# Altium schematic sheet Ind_current_sensor.SchDoc
size 508 x 508 mm
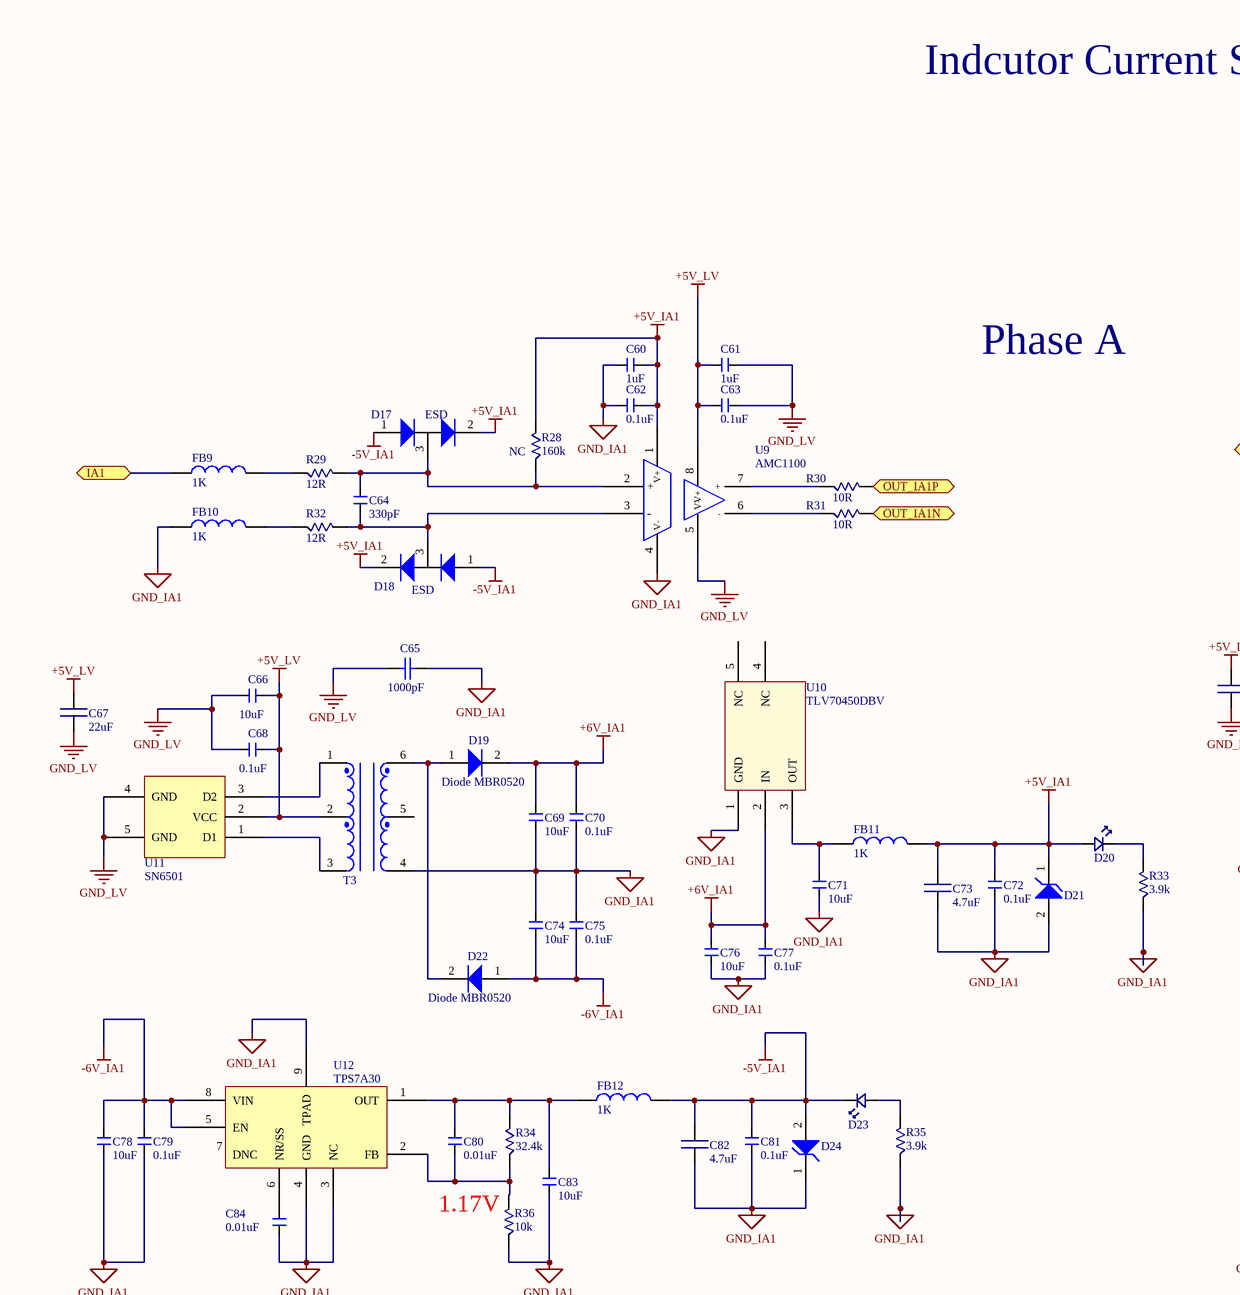
[diagram p0: Ind_current_sensor.SchDoc, top left]
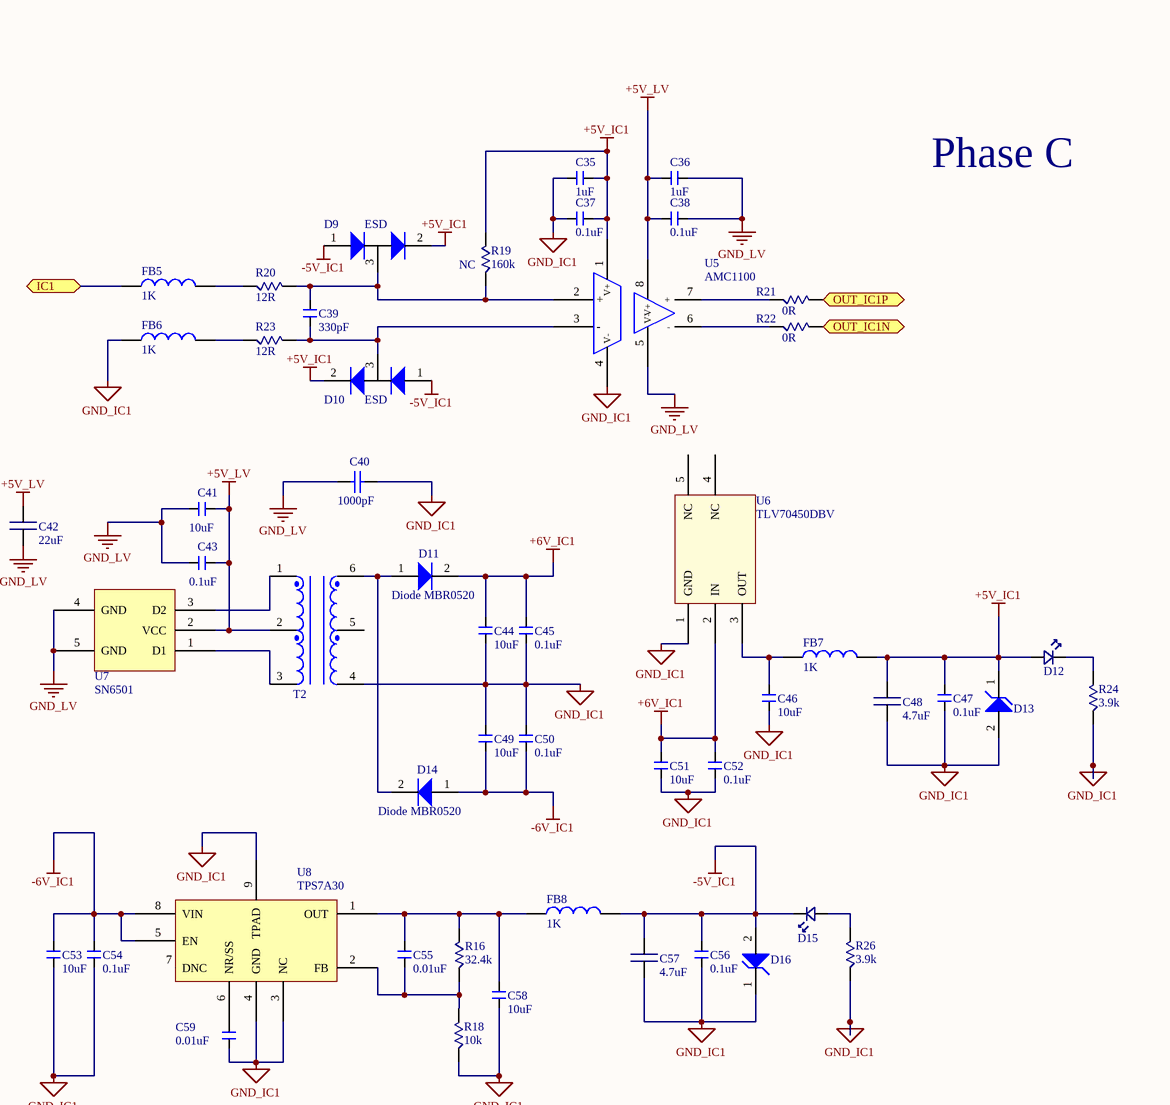
[diagram p1: Ind_current_sensor.SchDoc, top right]
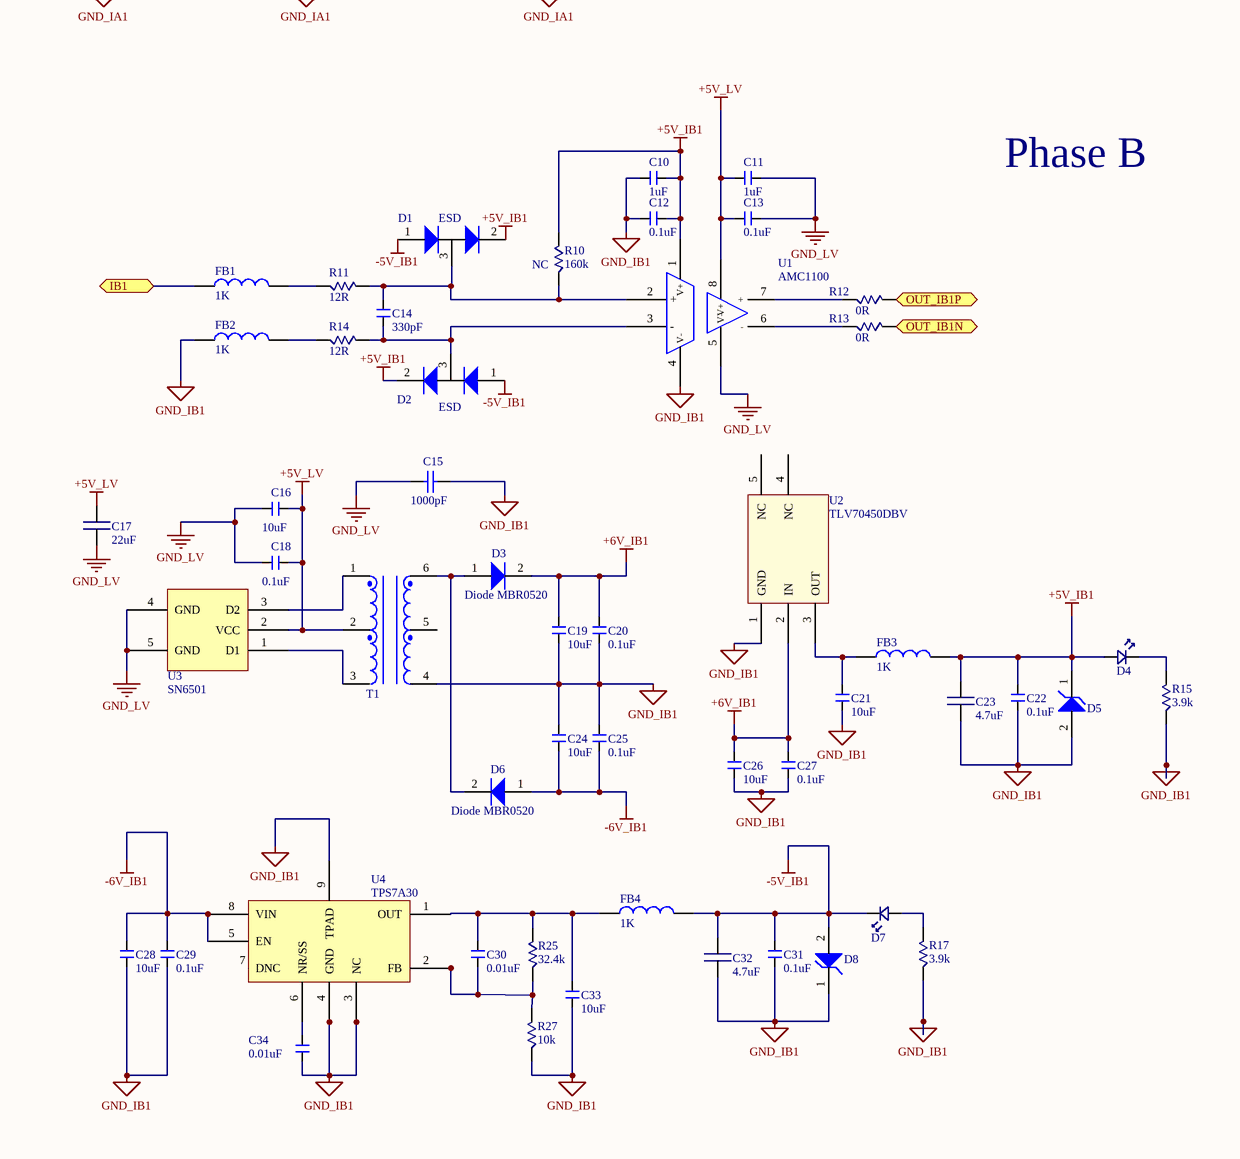
[diagram p2: Ind_current_sensor.SchDoc, bottom left]
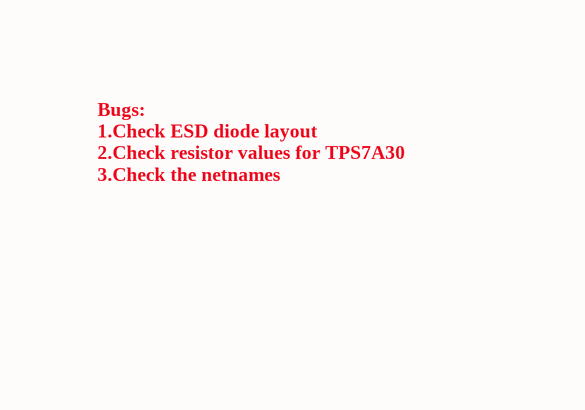
[diagram p3: Ind_current_sensor.SchDoc, bottom right]

## Parts
C10  value 1uF  [0603 (1608 Metric)]  (hidden comment: Cap 0603_new)
C11  value 1uF  [0603 (1608 Metric)]  (hidden comment: Cap 0603_new)
C12  value 0.1uF  [0603 (1608 Metric)]  (hidden comment: Cap 0603_new)
C13  value 0.1uF  [0603 (1608 Metric)]  (hidden comment: Cap 0603_new)
C14  value 330pF  [0603 (1608 Metric)]  (hidden comment: Cap 0603_new)
C15  value 1000pF  [RAD-0.3]  (hidden comment: Cap TH)
C16  value 10uF  [0603 (1608 Metric)]  (hidden comment: Cap 0603_new)
C17  value 22uF  [0805 (2012 metric)]  (hidden comment: Cap 0805)
C18  value 0.1uF  [0603 (1608 Metric)]  (hidden comment: Cap 0603_new)
C19  value 10uF  [0603 (1608 Metric)]  (hidden comment: Cap 0603_new)
C20  value 0.1uF  [0603 (1608 Metric)]  (hidden comment: Cap 0603_new)
C21  value 10uF  [0603 (1608 Metric)]  (hidden comment: Cap 0603_new)
C22  value 0.1uF  [0603 (1608 Metric)]  (hidden comment: Cap 0603_new)
C23  value 4.7uF  [0805 (2012 metric)]  (hidden comment: Cap 0805)
C24  value 10uF  [0603 (1608 Metric)]  (hidden comment: Cap 0603_new)
C25  value 0.1uF  [0603 (1608 Metric)]  (hidden comment: Cap 0603_new)
C26  value 10uF  [0603 (1608 Metric)]  (hidden comment: Cap 0603_new)
C27  value 0.1uF  [0603 (1608 Metric)]  (hidden comment: Cap 0603_new)
C28  value 10uF  [0603 (1608 Metric)]  (hidden comment: Cap 0603_new)
C29  value 0.1uF  [0603 (1608 Metric)]  (hidden comment: Cap 0603_new)
C30  value 0.01uF  [0603 (1608 Metric)]  (hidden comment: Cap 0603_new)
C31  value 0.1uF  [0603 (1608 Metric)]  (hidden comment: Cap 0603_new)
C32  value 4.7uF  [0805 (2012 metric)]  (hidden comment: Cap 0805)
C33  value 10uF  [0603 (1608 Metric)]  (hidden comment: Cap 0603_new)
C34  value 0.01uF  [0603 (1608 Metric)]  (hidden comment: Cap 0603_new)
C35  value 1uF  [0603 (1608 Metric)]  (hidden comment: Cap 0603_new)
C36  value 1uF  [0603 (1608 Metric)]  (hidden comment: Cap 0603_new)
C37  value 0.1uF  [0603 (1608 Metric)]  (hidden comment: Cap 0603_new)
C38  value 0.1uF  [0603 (1608 Metric)]  (hidden comment: Cap 0603_new)
C39  value 330pF  [0603 (1608 Metric)]  (hidden comment: Cap 0603_new)
C40  value 1000pF  [RAD-0.3]  (hidden comment: Cap TH)
C41  value 10uF  [0603 (1608 Metric)]  (hidden comment: Cap 0603_new)
C42  value 22uF  [0805 (2012 metric)]  (hidden comment: Cap 0805)
C43  value 0.1uF  [0603 (1608 Metric)]  (hidden comment: Cap 0603_new)
C44  value 10uF  [0603 (1608 Metric)]  (hidden comment: Cap 0603_new)
C45  value 0.1uF  [0603 (1608 Metric)]  (hidden comment: Cap 0603_new)
C46  value 10uF  [0603 (1608 Metric)]  (hidden comment: Cap 0603_new)
C47  value 0.1uF  [0603 (1608 Metric)]  (hidden comment: Cap 0603_new)
C48  value 4.7uF  [0805 (2012 metric)]  (hidden comment: Cap 0805)
C49  value 10uF  [0603 (1608 Metric)]  (hidden comment: Cap 0603_new)
C50  value 0.1uF  [0603 (1608 Metric)]  (hidden comment: Cap 0603_new)
C51  value 10uF  [0603 (1608 Metric)]  (hidden comment: Cap 0603_new)
C52  value 0.1uF  [0603 (1608 Metric)]  (hidden comment: Cap 0603_new)
C53  value 10uF  [0603 (1608 Metric)]  (hidden comment: Cap 0603_new)
C54  value 0.1uF  [0603 (1608 Metric)]  (hidden comment: Cap 0603_new)
C55  value 0.01uF  [0603 (1608 Metric)]  (hidden comment: Cap 0603_new)
C56  value 0.1uF  [0603 (1608 Metric)]  (hidden comment: Cap 0603_new)
C57  value 4.7uF  [0805 (2012 metric)]  (hidden comment: Cap 0805)
C58  value 10uF  [0603 (1608 Metric)]  (hidden comment: Cap 0603_new)
C59  value 0.01uF  [0603 (1608 Metric)]  (hidden comment: Cap 0603_new)
C60  value 1uF  [0603 (1608 Metric)]  (hidden comment: Cap 0603_new)
C61  value 1uF  [0603 (1608 Metric)]  (hidden comment: Cap 0603_new)
C62  value 0.1uF  [0603 (1608 Metric)]  (hidden comment: Cap 0603_new)
C63  value 0.1uF  [0603 (1608 Metric)]  (hidden comment: Cap 0603_new)
C64  value 330pF  [0603 (1608 Metric)]  (hidden comment: Cap 0603_new)
C65  value 1000pF  [RAD-0.3]  (hidden comment: Cap TH)
C66  value 10uF  [0603 (1608 Metric)]  (hidden comment: Cap 0603_new)
C67  value 22uF  [0805 (2012 metric)]  (hidden comment: Cap 0805)
C68  value 0.1uF  [0603 (1608 Metric)]  (hidden comment: Cap 0603_new)
C69  value 10uF  [0603 (1608 Metric)]  (hidden comment: Cap 0603_new)
C70  value 0.1uF  [0603 (1608 Metric)]  (hidden comment: Cap 0603_new)
C71  value 10uF  [0603 (1608 Metric)]  (hidden comment: Cap 0603_new)
C72  value 0.1uF  [0603 (1608 Metric)]  (hidden comment: Cap 0603_new)
C73  value 4.7uF  [0805 (2012 metric)]  (hidden comment: Cap 0805)
C74  value 10uF  [0603 (1608 Metric)]  (hidden comment: Cap 0603_new)
C75  value 0.1uF  [0603 (1608 Metric)]  (hidden comment: Cap 0603_new)
C76  value 10uF  [0603 (1608 Metric)]  (hidden comment: Cap 0603_new)
C77  value 0.1uF  [0603 (1608 Metric)]  (hidden comment: Cap 0603_new)
C78  value 10uF  [0603 (1608 Metric)]  (hidden comment: Cap 0603_new)
C79  value 0.1uF  [0603 (1608 Metric)]  (hidden comment: Cap 0603_new)
C80  value 0.01uF  [0603 (1608 Metric)]  (hidden comment: Cap 0603_new)
C81  value 0.1uF  [0603 (1608 Metric)]  (hidden comment: Cap 0603_new)
C82  value 4.7uF  [0805 (2012 metric)]  (hidden comment: Cap 0805)
C83  value 10uF  [0603 (1608 Metric)]  (hidden comment: Cap 0603_new)
C84  value 0.01uF  [0603 (1608 Metric)]  (hidden comment: Cap 0603_new)
D1  value ESD  [SOT323_ESD]  (hidden comment: TVS - Diodes)
D2  value ESD  [SOT323_ESD]  (hidden comment: TVS - Diodes)
D3  Diode MBR0520  [SOD-123]
D4  LED  [0805 (2012 Metric) Diode]  (value not drawn)
D5  Diode Zener POWERDI123  [POWERDI]  (value not drawn)
D6  Diode MBR0520  [SOD-123]
D7  LED  [0805 (2012 Metric) Diode]  (value not drawn)
D8  Diode Zener POWERDI123  [POWERDI]  (value not drawn)
D9  value ESD  [SOT323_ESD]  (hidden comment: TVS - Diodes)
D10  value ESD  [SOT323_ESD]  (hidden comment: TVS - Diodes)
D11  Diode MBR0520  [SOD-123]
D12  LED  [0805 (2012 Metric) Diode]  (value not drawn)
D13  Diode Zener POWERDI123  [POWERDI]  (value not drawn)
D14  Diode MBR0520  [SOD-123]
D15  LED  [0805 (2012 Metric) Diode]  (value not drawn)
D16  Diode Zener POWERDI123  [POWERDI]  (value not drawn)
D17  value ESD  [SOT323_ESD]  (hidden comment: TVS - Diodes)
D18  value ESD  [SOT323_ESD]  (hidden comment: TVS - Diodes)
D19  Diode MBR0520  [SOD-123]
D20  LED  [0805 (2012 Metric) Diode]  (value not drawn)
D21  Diode Zener POWERDI123  [POWERDI]  (value not drawn)
D22  Diode MBR0520  [SOD-123]
D23  LED  [0805 (2012 Metric) Diode]  (value not drawn)
D24  Diode Zener POWERDI123  [POWERDI]  (value not drawn)
FB1  value 1K  [0603 (1608 Metric)]  (hidden comment: Ferrite bead)
FB2  value 1K  [0603 (1608 Metric)]  (hidden comment: Ferrite bead)
FB3  value 1K  [0603 (1608 Metric)]  (hidden comment: Ferrite bead)
FB4  value 1K  [0603 (1608 Metric)]  (hidden comment: Ferrite bead)
FB5  value 1K  [0603 (1608 Metric)]  (hidden comment: Ferrite bead)
FB6  value 1K  [0603 (1608 Metric)]  (hidden comment: Ferrite bead)
FB7  value 1K  [0603 (1608 Metric)]  (hidden comment: Ferrite bead)
FB8  value 1K  [0603 (1608 Metric)]  (hidden comment: Ferrite bead)
FB9  value 1K  [0603 (1608 Metric)]  (hidden comment: Ferrite bead)
FB10  value 1K  [0603 (1608 Metric)]  (hidden comment: Ferrite bead)
FB11  value 1K  [0603 (1608 Metric)]  (hidden comment: Ferrite bead)
FB12  value 1K  [0603 (1608 Metric)]  (hidden comment: Ferrite bead)
R10  NC  value 160k  [0603 (1608 Metric)]
R11  value 12R  [1206]  (hidden comment: Resistor 1206)
R12  value 0R  [0603 (1608 Metric)]  (hidden comment: Resistor 0603)
R13  value 0R  [0603 (1608 Metric)]  (hidden comment: Resistor 0603)
R14  value 12R  [1206]  (hidden comment: Resistor 1206)
R15  value 3.9k  [0603 (1608 Metric)]  (hidden comment: Resistor 0603)
R16  value 32.4k  [0603 (1608 Metric)]  (hidden comment: Resistor 0603)
R17  value 3.9k  [0603 (1608 Metric)]  (hidden comment: Resistor 0603)
R18  value 10k  [0603 (1608 Metric)]  (hidden comment: Resistor 0603)
R19  NC  value 160k  [0603 (1608 Metric)]
R20  value 12R  [1206]  (hidden comment: Resistor 1206)
R21  value 0R  [0603 (1608 Metric)]  (hidden comment: Resistor 0603)
R22  value 0R  [0603 (1608 Metric)]  (hidden comment: Resistor 0603)
R23  value 12R  [1206]  (hidden comment: Resistor 1206)
R24  value 3.9k  [0603 (1608 Metric)]  (hidden comment: Resistor 0603)
R25  value 32.4k  [0603 (1608 Metric)]  (hidden comment: Resistor 0603)
R26  value 3.9k  [0603 (1608 Metric)]  (hidden comment: Resistor 0603)
R27  value 10k  [0603 (1608 Metric)]  (hidden comment: Resistor 0603)
R28  NC  value 160k  [0603 (1608 Metric)]
R29  value 12R  [1206]  (hidden comment: Resistor 1206)
R30  value 10R  [0603 (1608 Metric)]  (hidden comment: Resistor 0603)
R31  value 10R  [0603 (1608 Metric)]  (hidden comment: Resistor 0603)
R32  value 12R  [1206]  (hidden comment: Resistor 1206)
R33  value 3.9k  [0603 (1608 Metric)]  (hidden comment: Resistor 0603)
R34  value 32.4k  [0603 (1608 Metric)]  (hidden comment: Resistor 0603)
R35  value 3.9k  [0603 (1608 Metric)]  (hidden comment: Resistor 0603)
R36  value 10k  [0603 (1608 Metric)]  (hidden comment: Resistor 0603)
T1  750313769  [Xmr SN6501]  (value not drawn)
T2  750313769  [Xmr SN6501]  (value not drawn)
T3  750313769  [Xmr SN6501]  (value not drawn)
U1  AMC1100  [SOIC8]
U2  TLV70450DBV  [SOT23-5]
U3  SN6501  [SOT23-5]
U4  TPS7A30  [8-TSSOP]
U5  AMC1100  [SOIC8]
U6  TLV70450DBV  [SOT23-5]
U7  SN6501  [SOT23-5]
U8  TPS7A30  [8-TSSOP]
U9  AMC1100  [SOIC8]
U10  TLV70450DBV  [SOT23-5]
U11  SN6501  [SOT23-5]
U12  TPS7A30  [8-TSSOP]

## Ports
IA1, IB1, IC1, OUT_IA1N, OUT_IA1P, OUT_IB1N, OUT_IB1P, OUT_IC1N, OUT_IC1P

## Nets
+5V_IA1: C60.2(OUT) C62.2(OUT) C72.2(OUT) C73.2(OUT) D17.2(node) D18.2(node) D20.A D21.1(Anode) FB11.2(OUT) R28.2(A) U9.1(V+)
+5V_IB1: C10.2(OUT) C12.2(OUT) C22.2(OUT) C23.2(OUT) D1.2(node) D2.2(node) D4.A D5.1(Anode) FB3.2(OUT) R10.2(A) U1.1(V+)
+5V_IC1: C35.2(OUT) C37.2(OUT) C47.2(OUT) C48.2(OUT) D9.2(node) D10.2(node) D12.A D13.1(Anode) FB7.2(OUT) R19.2(A) U5.1(V+)
+5V_LV: C11.1(OUT) C13.1(OUT) C16.2(OUT) C17.2(OUT) C18.2(OUT) C36.1(OUT) C38.1(OUT) C41.2(OUT) C42.2(OUT) C43.2(OUT) C61.1(OUT) C63.1(OUT) C66.2(OUT) C67.2(OUT) C68.2(OUT) T1.2 T2.2 T3.2 U1.8(V+) U3.2(VCC) U5.8(V+) U7.2(VCC) U9.8(V+) U11.2(VCC)
+6V_IA1: C69.2(OUT) C70.2(OUT) C76.2(OUT) C77.2(OUT) D19.2(Anode) U10.2(IN)
+6V_IB1: C19.2(OUT) C20.2(OUT) C26.2(OUT) C27.2(OUT) D3.2(Anode) U2.2(IN)
+6V_IC1: C44.2(OUT) C45.2(OUT) C51.2(OUT) C52.2(OUT) D11.2(Anode) U6.2(IN)
-5V_IA1: C81.2(OUT) C82.2(OUT) D17.1(node) D18.1(node) D23.K D24.2(Anode) FB12.2(OUT)
-5V_IB1: C31.2(OUT) C32.2(OUT) D1.1(node) D2.1(node) D7.K D8.2(Anode) FB4.2(OUT)
-5V_IC1: C56.2(OUT) C57.2(OUT) D9.1(node) D10.1(node) D15.K D16.2(Anode) FB8.2(OUT)
-6V_IA1: C74.1(OUT) C75.1(OUT) C78.2(OUT) C79.2(OUT) D22.1(Anode) U12.5(EN) U12.8(VIN)
-6V_IB1: C24.1(OUT) C25.1(OUT) C28.2(OUT) C29.2(OUT) D6.1(Anode) U4.5(EN) U4.8(VIN)
-6V_IC1: C49.1(OUT) C50.1(OUT) C53.2(OUT) C54.2(OUT) D14.1(Anode) U8.5(EN) U8.8(VIN)
GND_IA1: C60.1(OUT) C62.1(OUT) C65.2 C69.1(OUT) C70.1(OUT) C71.1(OUT) C72.1(OUT) C73.1(OUT) C74.2(OUT) C75.2(OUT) C76.1(OUT) C77.1(OUT) C78.1(OUT) C79.1(OUT) C81.1(OUT) C82.1(OUT) C83.1(OUT) C84.1(OUT) D21.2(Anode) D24.1(Anode) FB10.1(OUT) R33.1(A) R35.1(A) R36.1(A) T3.4 U9.4(V-) U10.1(GND) U12.3(NC) U12.4(GND) U12.9(TPAD)
GND_IB1: C10.1(OUT) C12.1(OUT) C15.2 C19.1(OUT) C20.1(OUT) C21.1(OUT) C22.1(OUT) C23.1(OUT) C24.2(OUT) C25.2(OUT) C26.1(OUT) C27.1(OUT) C28.1(OUT) C29.1(OUT) C31.1(OUT) C32.1(OUT) C33.1(OUT) C34.1(OUT) D5.2(Anode) D8.1(Anode) FB2.1(OUT) R15.1(A) R17.1(A) R27.1(A) T1.4 U1.4(V-) U2.1(GND) U4.3(NC) U4.4(GND) U4.9(TPAD)
GND_IC1: C35.1(OUT) C37.1(OUT) C40.2 C44.1(OUT) C45.1(OUT) C46.1(OUT) C47.1(OUT) C48.1(OUT) C49.2(OUT) C50.2(OUT) C51.1(OUT) C52.1(OUT) C53.1(OUT) C54.1(OUT) C56.1(OUT) C57.1(OUT) C58.1(OUT) C59.1(OUT) D13.2(Anode) D16.1(Anode) FB6.1(OUT) R18.1(A) R24.1(A) R26.1(A) T2.4 U5.4(V-) U6.1(GND) U8.3(NC) U8.4(GND) U8.9(TPAD)
GND_LV: C11.2(OUT) C13.2(OUT) C15.1 C16.1(OUT) C17.1(OUT) C18.1(OUT) C36.2(OUT) C38.2(OUT) C40.1 C41.1(OUT) C42.1(OUT) C43.1(OUT) C61.2(OUT) C63.2(OUT) C65.1 C66.1(OUT) C67.1(OUT) C68.1(OUT) U1.5(V-) U3.4(GND) U3.5(GND) U5.5(V-) U7.4(GND) U7.5(GND) U9.5(V-) U11.4(GND) U11.5(GND)
IA1: FB9.1(OUT) ; port IA1
IB1: FB1.1(OUT) ; port IB1
IC1: FB5.1(OUT) ; port IC1
OUT_IA1N: R31.2(A) ; port OUT_IA1N
OUT_IA1P: R30.2(A) ; port OUT_IA1P
OUT_IB1N: R13.2(A) ; port OUT_IB1N
OUT_IB1P: R12.2(A) ; port OUT_IB1P
OUT_IC1N: R22.2(A) ; port OUT_IC1N
OUT_IC1P: R21.2(A) ; port OUT_IC1P
NetC14_1: C14.1(OUT) D1.3(node) R10.1(A) R11.2(A) U1.2(+)
NetC14_2: C14.2(OUT) D2.3(node) R14.2(A) U1.3(-)
NetC21_2: C21.2(OUT) FB3.1(OUT) U2.3(OUT)
NetC30_1: C30.1(OUT) C33.2(OUT) FB4.1(OUT) R25.2(A) U4.1(OUT)
NetC30_2: C30.2(OUT) R25.1(A) R27.2(A) U4.2(FB)
NetC34_2: C34.2(OUT) U4.6(NR/SS)
NetC39_1: C39.1(OUT) D9.3(node) R19.1(A) R20.2(A) U5.2(+)
NetC39_2: C39.2(OUT) D10.3(node) R23.2(A) U5.3(-)
NetC46_2: C46.2(OUT) FB7.1(OUT) U6.3(OUT)
NetC55_1: C55.1(OUT) C58.2(OUT) FB8.1(OUT) R16.2(A) U8.1(OUT)
NetC55_2: C55.2(OUT) R16.1(A) R18.2(A) U8.2(FB)
NetC59_2: C59.2(OUT) U8.6(NR/SS)
NetC64_1: C64.1(OUT) D17.3(node) R28.1(A) R29.2(A) U9.2(+)
NetC64_2: C64.2(OUT) D18.3(node) R32.2(A) U9.3(-)
NetC71_2: C71.2(OUT) FB11.1(OUT) U10.3(OUT)
NetC80_1: C80.1(OUT) C83.2(OUT) FB12.1(OUT) R34.2(A) U12.1(OUT)
NetC80_2: C80.2(OUT) R34.1(A) R36.2(A) U12.2(FB)
NetC84_2: C84.2(OUT) U12.6(NR/SS)
NetD3_1: D3.1(Anode) D6.2(Anode) T1.6
NetD4_K: D4.K R15.2(A)
NetD7_A: D7.A R17.2(A)
NetD11_1: D11.1(Anode) D14.2(Anode) T2.6
NetD12_K: D12.K R24.2(A)
NetD15_A: D15.A R26.2(A)
NetD19_1: D19.1(Anode) D22.2(Anode) T3.6
NetD20_K: D20.K R33.2(A)
NetD23_A: D23.A R35.2(A)
NetFB1_2: FB1.2(OUT) R11.1(A)
NetFB2_2: FB2.2(OUT) R14.1(A)
NetFB5_2: FB5.2(OUT) R20.1(A)
NetFB6_2: FB6.2(OUT) R23.1(A)
NetFB9_2: FB9.2(OUT) R29.1(A)
NetFB10_2: FB10.2(OUT) R32.1(A)
NetR12_1: R12.1(A) U1.7(+)
NetR13_1: R13.1(A) U1.6(-)
NetR21_1: R21.1(A) U5.7(+)
NetR22_1: R22.1(A) U5.6(-)
NetR30_1: R30.1(A) U9.7(+)
NetR31_1: R31.1(A) U9.6(-)
NetT1_1: T1.1 U3.3(D2)
NetT1_3: T1.3 U3.1(D1)
NetT2_1: T2.1 U7.3(D2)
NetT2_3: T2.3 U7.1(D1)
NetT3_1: T3.1 U11.3(D2)
NetT3_3: T3.3 U11.1(D1)

Not connected (* = marked no-connect by the designer): T1 5(1); T2 5(1); T3 5(1); U2 4(NC) 5(NC); U4 7(DNC); U6 4(NC) 5(NC); U8 7(DNC); U10 4(NC) 5(NC); U12 7(DNC)

## Notes on the sheet
- Indcutor Current Sensors
- Phase C
- Phase A
- (near R36) 1.17V
- Phase B
- Bugs:
  1.Check ESD diode layout
  2.Check resistor values for TPS7A30
  3.Check the netnames

## Library data of the parts
C10 C11 C35 C36 C60 C61 = Cap 0603_new: CAP CER 1UF 50V X5R 0603; part: 1276-1860-1-ND
C12 C13 C18 C20 C22 C25 C27 C29 C31 C37 C38 C43 C45 C47 C50 C52 C54 C56 C62 C63 C68 C70 C72 C75 C77 C79 C81 = Cap 0603_new: CAP CER 0.1UF 50V Y5V 0603; part: 311-1343-6-ND
C14 C39 C64 = Cap 0603_new: CAP CER 330PF 50V C0G 0603; part: 445-7033-2-ND
C15 C40 C65 = Cap: CAP CER 1000PF 1KV Y5P RADIAL; Part: 1251PH-ND; Published: 8-Jun-2000; LatestRevisionDate: 17-Jul-2002; LatestRevisionNote: Re-released for DXP Platform.; PackageReference: RAD-0.3; Publisher: Altium Limited; PackageDescription: Radial Cap, Thru-Hole; 2 Leads; 0.3 in Pin Spacing
C16 C19 C21 C24 C26 C28 C33 C41 C44 C46 C49 C51 C53 C58 C66 C69 C71 C74 C76 C78 C83 = Cap 0603_new: CAP CER 10UF 35V X5R 0805; part: 490-10515-1-ND
C17 C42 C67 = Cap 0805: CAP CER 22UF 35V X5R 0805; Part: 445-14428-1-ND
C23 C32 C48 C57 C73 C82 = Cap 0805: CAP CER 4.7UF 50V X5R 0805; Part: 445-5980-1-ND
C30 C34 C55 C59 C80 C84 = Cap 0603_new: CAP CER 10000PF 100V X7R 0603; part: 478-7418-1-ND
D1 D2 D9 D10 D17 D18 = Diode_ESD: TVS DIODE; Part: ESD1P0RFWH6327XTSA1CT
D3 D6 D11 D14 D19 D22 = Diode MBR0520: DIODE SCHOTTKY 20V 500MA SOD123; Part: MBR0520LT1GOSCT-ND; Value: *
D4 D7 D12 D15 D20 D23 = LED: LED 0805
D5 D8 D13 D16 D21 D24 = Diode Zener POWERDI123: Part: DFLZ6V2DICT-ND; Value: *
FB1-FB12 = Ferrite bead: FERRITE BEAD 1 KOHM 0603 1LN; Part: 445-8672-1-ND
R10 R19 R28 = Resistor 0603
R11 R14 R20 R23 R29 R32 = Resistor 1206: 12 Ohm ±0.5% 0.25W, 1/4W Chip Resistor 1206; Part: 311-2961-1-ND
R12 R13 R21 R22 R30 R31 = Resistor 0603: RES SMD 10 OHM 0.05% 1/10W 0603; Part: RNCF0603AKT10R0CT-ND
R15 R17 R24 R26 R33 R35 = Resistor 0603: RES SMD 3.9K OHM 5% 1/10W 0603; Part: 541-3.9KGCT-ND
R16 R25 R34 = Resistor 0603: RES SMD 32.4KOHM 0.5% 1/10W 0603; Part: 311-32.4KDCT-ND
R18 R27 R36 = Resistor 0603: RES SMD 10K OHM 0.5% 1/16W 0603; Part: RR08P10.0KDCT-ND
T1-T3 = 750313769: TRANSFORMER SMD TR1.7 SN6501; Part: 1297-1107-1-ND
U1 U5 U9 = AMC1100: IC OPAMP ISOLATION 100KHZ 8SOIC; Part: 296-38822-5-ND
U2 U6 U10 = TLV70450DBV: IC REG LDO 5V 0.15A SOT23-5; Part: 296-39287-1-ND
U3 U7 U11 = SN6501: IC REG CONV PWR SUPPLIES SOT23-5; Part: 296-37700-1-ND; Value: *
U4 U8 U12 = TPS7A30: IC REG LDO NEG ADJ 0.2A 8MSOP; Part: 296-27750-1-ND